# EAGLE design buck_converter (EAGLE 9.6.2)
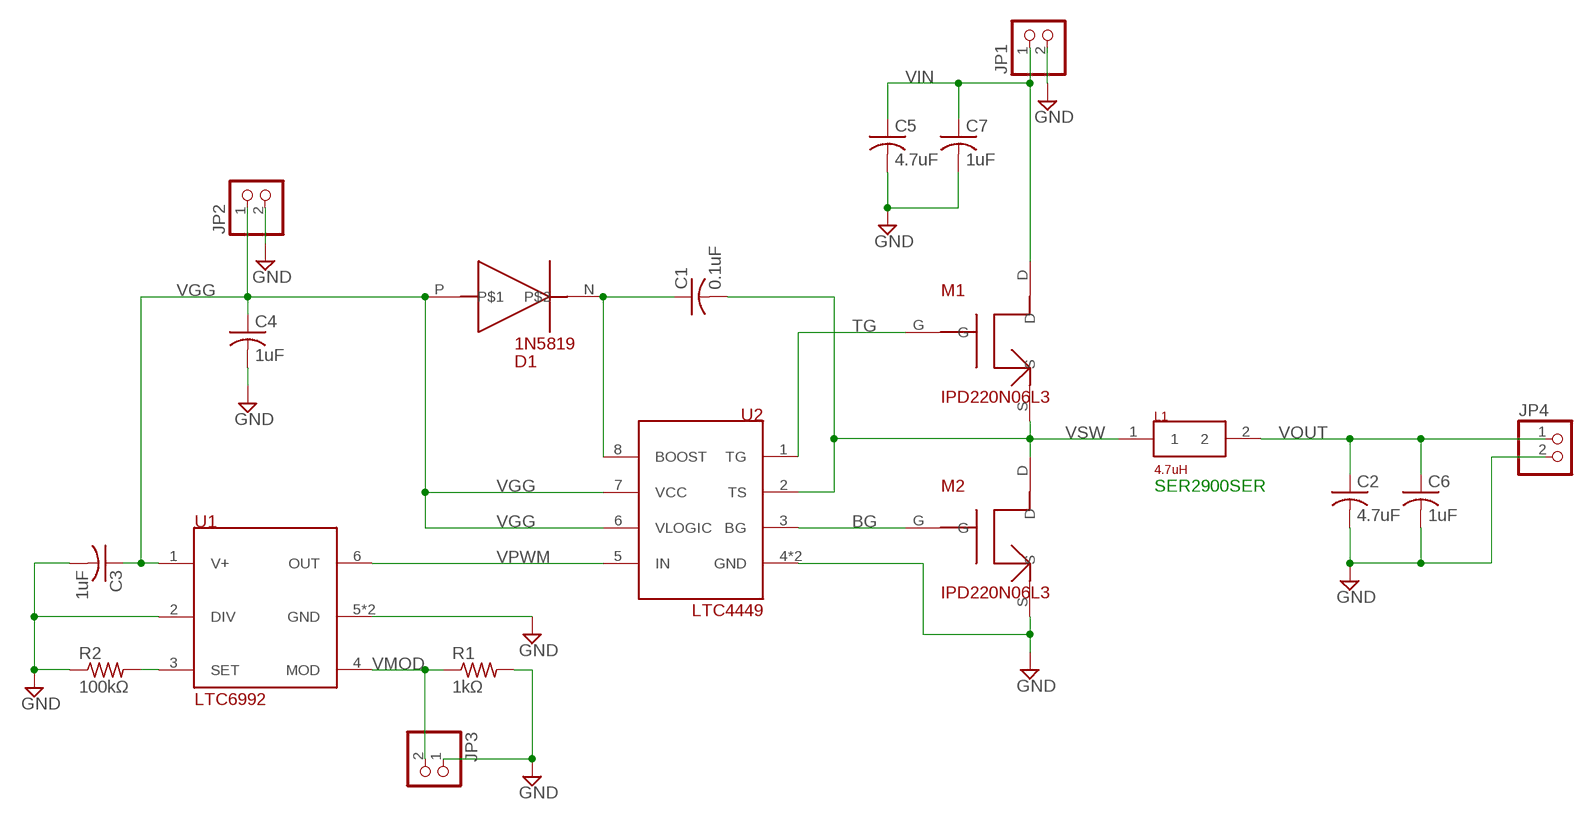
[diagram p0: schematic, sheet 1]

## Parts
C1  0.1uF  C-US  [C0805]
C2  4.7uF  C-USC1206  [C1206]
C3  1uF  C-US  [C0805]
C4  1uF  C-US  [C0805]
C5  4.7uF  C-USC1206  [C1206]
C6  1uF  C-US  [C0805]
C7  1uF  C-US  [C0805]
D1  1N5819  DIODE  [SOD123]
JP1  PINHD-1X2  [1X02]
JP2  PINHD-1X2  [1X02]
JP3  PINHD-1X2  [1X02]
JP4  PINHD-1X2  [1X02]
L1  4.7uH  SER2900SER  [SER2900]
M1  IPD220N06L3  MOSFET_DPAK  [DPAK]
M2  IPD220N06L3  MOSFET_DPAK  [DPAK]
R1  1kΩ  R-US  [R0805]
R2  100kΩ  R-US  [R0805]
U1  LTC6992  [LTC6992]
U2  LTC4449  [DCB8]

## Nets
BG: M2.G U2.3(BG)
GND: C2.2 C3.2 C4.2 C5.2 C6.2 C7.2 JP1.2 JP2.2 JP3.1 JP4.2 M2.S R1.2 R2.1 U1.2(DIV) U1.5(GND) U1.7(GND) U2.4(GND) U2.9(GND)
N$1: R2.2 U1.3(SET)
N$2: C1.1 D1.N U2.8(BOOST)
TG: M1.G U2.1(TG)
VGG: C3.1 C4.1 D1.P JP2.1 U1.1(V+) U2.6(VLOGIC) U2.7(VCC)
VIN: C5.1 C7.1 JP1.1 M1.D
VMOD: JP3.2 R1.1 U1.4(MOD)
VOUT: C2.1 C6.1 JP4.1 L1.2
VPWM: U1.6(OUT) U2.5(IN)
VSW: C1.2 L1.1 M1.S M2.D U2.2(TS)

## Notes on the sheet
- SER2900SER

## Library data of the parts
C1 C3 C4 C6 C7 = Engs125_library:C-US: 0805 capacitor footprint.
C2 C5 = rcl:C-US: CAPACITOR, American symbol; SPICEPREFIX: C
D1 = Engs125_library:DIODE: Diode with SOD123 package.
JP1-JP4 = Engs125_library:PINHD-1X2: PIN HEADER
L1 = Engs125_library:SER2900: Inductor SER2900: http://www.coilcraft.com/ser2900.cfm
M1 M2 = Engs125_library:MOSFET_DPAK: MSOFET with DPAK footprint.
R1 R2 = Engs125_library:R-US
U1 = Engs125_library:LTC6992: LTC6992 is a silicon oscillator with an easy-to-use analog voltage-controlled pulse width modulation (PWM) capability.
U2 = Engs125_library:LTC4449: Linear Technology LTC4449 gate driver, a high frequency gate driver that is designed to drive two N-Channel MOSFETs in a synchronous DC/DC converter.2mm by 3mm DFN package. Date created: 10/4/2017

## Board
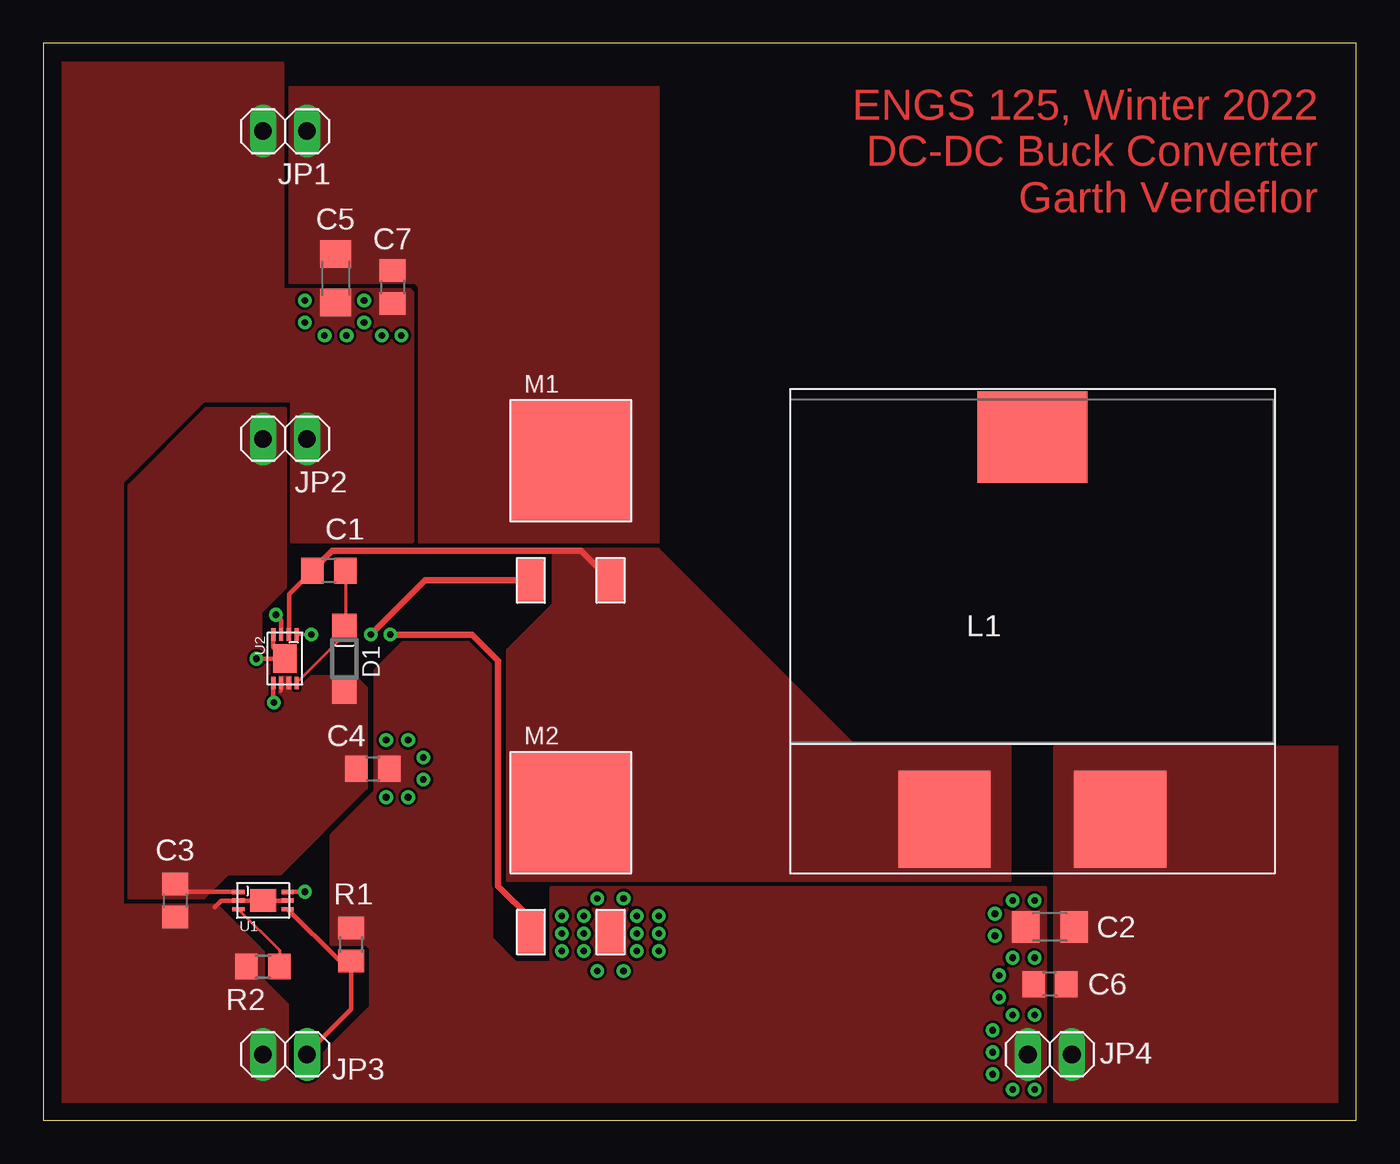
[diagram p1: board, top side]
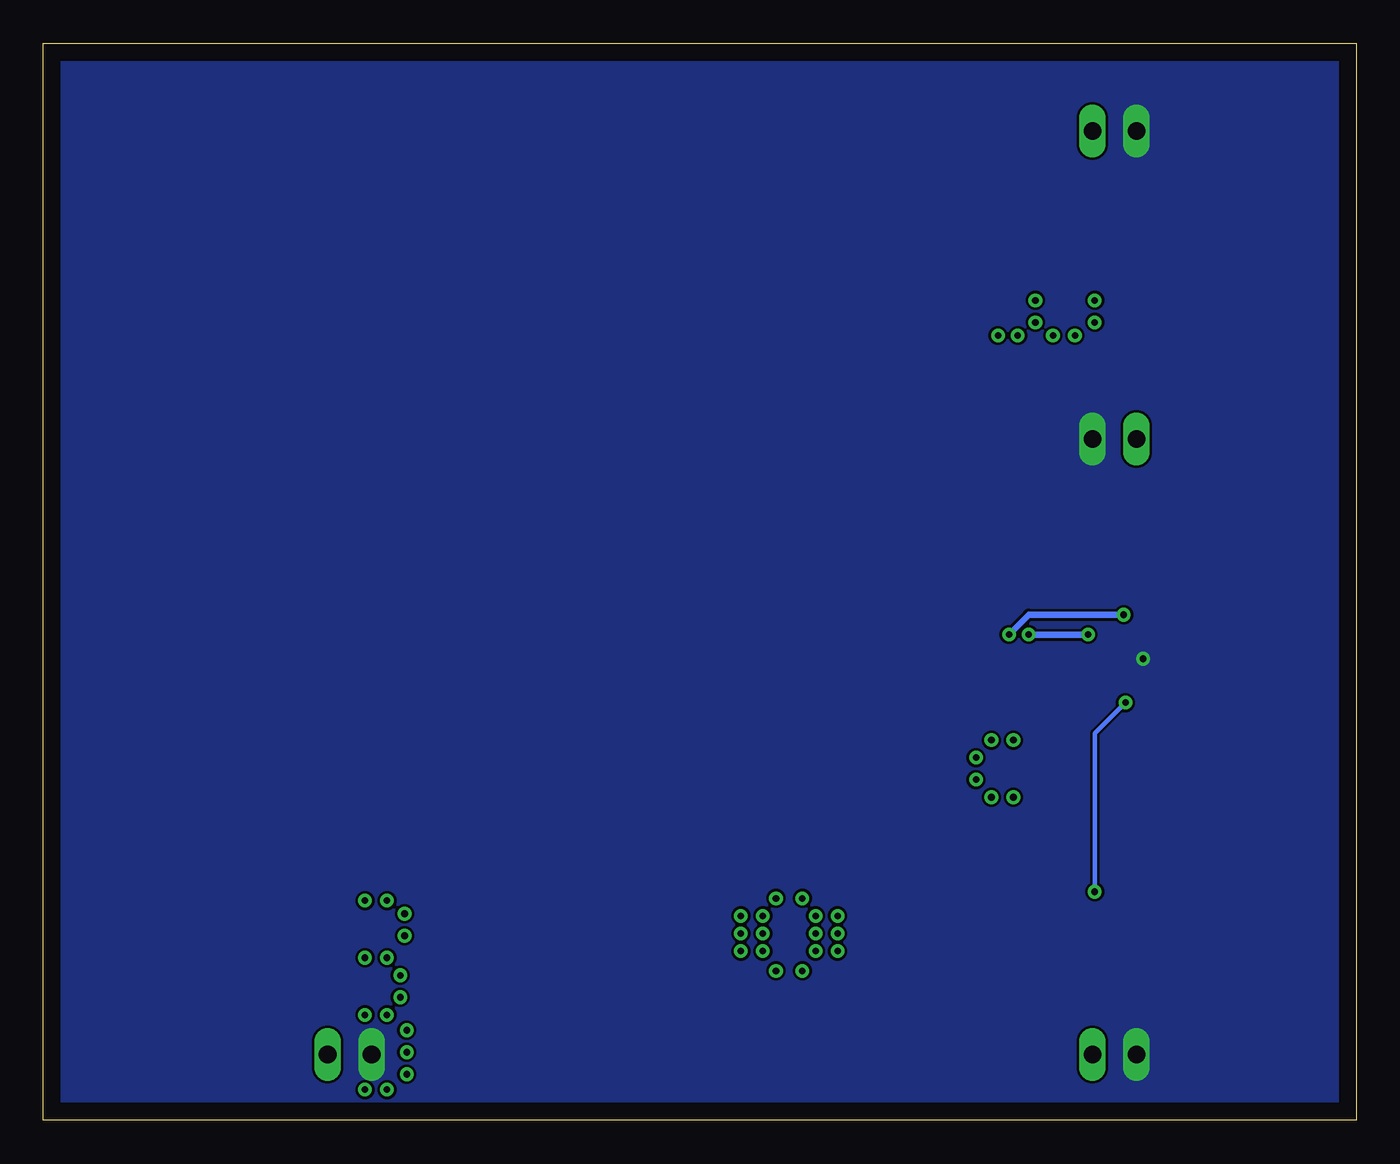
[diagram p2: board, bottom side, seen from below]

Size 75.87 x 62.22 mm. Coordinates in mm from the lower left corner, seen from the top.
Outline: 0,0 75.87,0 75.87,62.22 0,62.22 0,0
Copper layers (1*16): Top 0.035mm / dielectric 1.5mm / Bottom 0.035mm
Design rules "default *": minimum track width 6mil, minimum drill 15mil, track to track 6mil, track to pad 6mil, pad to pad 6mil, via to via 6mil, smd to smd 6mil, copper to edge 40mil, drill to drill 6mil, minimum pad ring 10mil, minimum via ring 8mil, stop-mask expansion 4mil, vias tented up to drill 0mil, thermal gap 10mil

### Footprints (pad centres in the part's own frame; a part is rotated, then mirrored left to right if it is on the bottom)
C0805 = smd 1.3 x 1.5: 1 -0.95,0; 2 0.95,0
C1206 = smd 1.6 x 1.8: 1 -1.4,0; 2 1.4,0
SOD123 = smd 1.4 x 1.4: N 1.9,0; P -1.9,0
1X02 = drill 1.016 long: 1 -1.27,0; 2 1.27,0
SER2900 = smd 5.334 x 5.588: 1 -5.08,-14.351; 2 5.08,-14.351 | smd 6.35 x 5.283: EXTRA 0,7.722
DPAK = smd 7 x 7: D 0,0 | smd 1.5 x 2.5: G -2.3,-6.9; S 2.3,-6.9
R0805 = smd 1.3 x 1.5: 1 -0.95,0; 2 0.95,0
LTC6992 = smd 0.25 x 0.7: 1 -0.5,-1.425; 2 0,-1.425; 3 0.5,-1.425; 4 0.5,1.425; 5 0,1.425; 6 -0.5,1.425 | smd 1.3 x 1.5: 7 0,0
DCB8 = smd 0.25 x 0.7: 1 -0.675,-1.4; 2 -0.225,-1.4; 3 0.225,-1.4; 4 0.675,-1.4; 5 0.675,1.4; 6 0.225,1.4; 7 -0.225,1.4; 8 -0.675,1.4 | smd 1.35 x 1.65: 9 0,0

### Placement (x,y rotation side)
C1  16.51,31.75 180 top
C2  58.17,11.18 180 top
C3  7.62,12.7 270 top
C4  19.05,20.32 0 top
C5  16.89,48.64 270 top
C6  58.17,7.87 180 top
C7  20.19,48.13 270 top
D1  17.4,26.67 90 top
JP1  13.97,57.15 180 top
JP2  13.97,39.37 0 top
JP3  13.97,3.81 0 top
JP4  58.17,3.81 180 top
L1  57.15,31.75 0 top
M1  30.48,38.1 0 top
M2  30.48,17.78 0 top
R1  17.78,10.16 90 top
R2  12.7,8.89 0 top
U1  12.7,12.7 270 top
U2  13.97,26.67 180 top

### Tracks (layer width: path | path; a pad name or v marks a point on that pad's centre or on a via)
BG  (via drill 0.38)
  Top 0.254: v13.43,29.21 13.74,28.9 U2.3
  Top 0.381: M2.G 28.18,11.64 26.29,13.53 26.29,26.54 24.77,28.07 v20.07,28.07
  Bottom 0.381: v20.07,28.07 18.92,29.21 v13.43,29.21
GND  (via drill 0.38)
  Top 0.254: U2.4 13.29,27.34 U2.9 v12.32,26.67 | 9.91,12.32 10.29,12.7 U1.2 U1.7 U1.5
  pour Bottom (isolate 0, no thermals): -0.13,62.36 76.07,62.36 76.07,-0.13 -0.13,-0.13
  pour Top (isolate 0, no thermals): 57.91,13.46 57.91,0.89 1.02,0.89 1.02,61.09 13.84,61.09 13.84,48.01 21.21,48.01 21.34,47.88 21.34,33.4 14.35,33.4 14.35,41.53 9.27,41.53 4.57,36.83 4.57,12.45 10.03,12.45 12.7,9.78 12.7,8.13 14.1,6.73 14.1,2.67 14.99,2.67 18.92,6.6 18.92,9.91 18.67,10.16 16.64,10.16 16.64,16.51 19.18,19.05 19.18,26.04 20.83,27.69 24.51,27.69 25.91,26.29 25.91,10.54 27.3,9.14 29.34,9.14 29.34,13.46
N$1
  Top 0.178: U1.3 13.65,9.82 R2.2
N$2
  Top 0.178: 17.4,28.45 17.4,28.02 U2.8 | C1.1 17.46,28.51 17.4,28.45 | D1.N 17.4,28.45
N$3  (via drill 0.38)
  other vias: 29.97,11.81
N$4  (via drill 0.38)
  other vias: 31.24,11.81
N$5  (via drill 0.38)
  other vias: 29.97,10.79
N$6  (via drill 0.38)
  other vias: 31.24,10.79
N$7  (via drill 0.38)
  other vias: 29.97,9.78
N$8  (via drill 0.38)
  other vias: 31.24,9.78
N$9  (via drill 0.38)
  other vias: 34.29,11.81
N$10  (via drill 0.38)
  other vias: 35.56,11.81
N$11  (via drill 0.38)
  other vias: 34.29,10.79
N$12  (via drill 0.38)
  other vias: 35.56,10.79
N$13  (via drill 0.38)
  other vias: 34.29,9.78
N$14  (via drill 0.38)
  other vias: 35.56,9.78
N$15  (via drill 0.38)
  other vias: 57.28,9.4
N$16  (via drill 0.38)
  other vias: 56.01,9.4
N$17  (via drill 0.38)
  other vias: 32,12.83
N$18  (via drill 0.38)
  other vias: 33.53,12.83
N$19  (via drill 0.38)
  other vias: 55.24,8.38
N$20  (via drill 0.38)
  other vias: 32,8.64
N$21  (via drill 0.38)
  other vias: 33.53,8.64
N$22  (via drill 0.38)
  other vias: 55.24,7.11
N$23  (via drill 0.38)
  other vias: 56.01,6.1
N$24  (via drill 0.38)
  other vias: 57.28,6.1
N$25  (via drill 0.38)
  other vias: 57.28,12.7
N$26  (via drill 0.38)
  other vias: 56.01,12.7
N$27  (via drill 0.38)
  other vias: 54.99,11.94
N$28  (via drill 0.38)
  other vias: 54.99,10.67
N$29  (via drill 0.38)
  other vias: 54.86,5.21
N$30  (via drill 0.38)
  other vias: 54.86,3.94
N$31  (via drill 0.38)
  other vias: 54.86,2.67
N$32  (via drill 0.38)
  other vias: 57.28,1.78
N$33  (via drill 0.38)
  other vias: 56.01,1.78
N$34  (via drill 0.38)
  other vias: 19.81,21.97
N$35  (via drill 0.38)
  other vias: 19.81,18.67
N$36  (via drill 0.38)
  other vias: 21.08,18.67
N$37  (via drill 0.38)
  other vias: 21.97,19.68
N$38  (via drill 0.38)
  other vias: 21.97,20.95
N$39  (via drill 0.38)
  other vias: 21.08,21.97
N$40  (via drill 0.38)
  other vias: 18.54,47.37
N$41  (via drill 0.38)
  other vias: 15.11,47.37
N$42  (via drill 0.38)
  other vias: 20.7,45.34
N$43  (via drill 0.38)
  other vias: 19.56,45.34
N$44  (via drill 0.38)
  other vias: 18.54,46.1
N$45  (via drill 0.38)
  other vias: 15.11,46.1
N$46  (via drill 0.38)
  other vias: 16.26,45.34
N$47  (via drill 0.38)
  other vias: 17.53,45.34
TG  (via drill 0.38)
  Top 0.178: v15.49,28.07 U2.1
  Top 0.381: M1.G 22.06,31.2 v18.92,28.07
  Bottom 0.381: v18.92,28.07 v15.49,28.07
VGG
  Top 0.178: U2.6 13.74,24.79 13.72,24.77 | C3.1 8.07,13.2
  Top 0.254: 8.07,13.2 U1.1
  pour Top (isolate 0, no thermals): 13.97,41.15 13.97,30.73 12.57,29.34 12.57,27.43 14.35,25.65 18.03,25.65 18.67,25.02 18.67,19.18 13.72,14.22 10.67,14.22 9.27,12.83 4.95,12.83 4.95,36.7 9.4,41.15
VIN
  pour Top (isolate 0, no thermals): 14.22,59.69 14.22,48.39 21.46,48.39 21.72,48.13 21.72,33.4 35.56,33.4 35.56,59.69
VMOD
  Top 0.178: JP3.2 15.24,3.88
  Top 0.254: 15.24,3.88 17.78,6.42 R1.1 17.11,9.21 U1.4
VOUT
  pour Top (isolate 0, no thermals): 58.42,21.59 58.42,0 76.2,0 76.2,21.59
VPWM  (via drill 0.38)
  Top 0.178: v15.11,13.21 v15.11,13.2
  Top 0.254: v15.11,13.2 U1.6 | v13.34,24.13 13.29,24.17 U2.5
  Bottom 0.254: v13.34,24.13 15.11,22.35 v15.11,13.21
VSW
  Top 0.254: C1.2 14.2,30.39 U2.2
  Top 0.381: M1.S 31.09,32.89 16.7,32.89 C1.2
  pour Top (isolate 0, no thermals): 26.8,27.18 26.8,13.84 55.88,13.84 55.88,21.59 46.99,21.59 35.56,33.02 29.46,33.02 29.46,29.84

### Text on the board
Top: ENGS 125, Winter 2022 / DC-DC Buck Converter / Garth Verdeflor